# Altium project STM32MP15XXAC_2DDR3Lx16.PrjPcb (part 2 of 2)
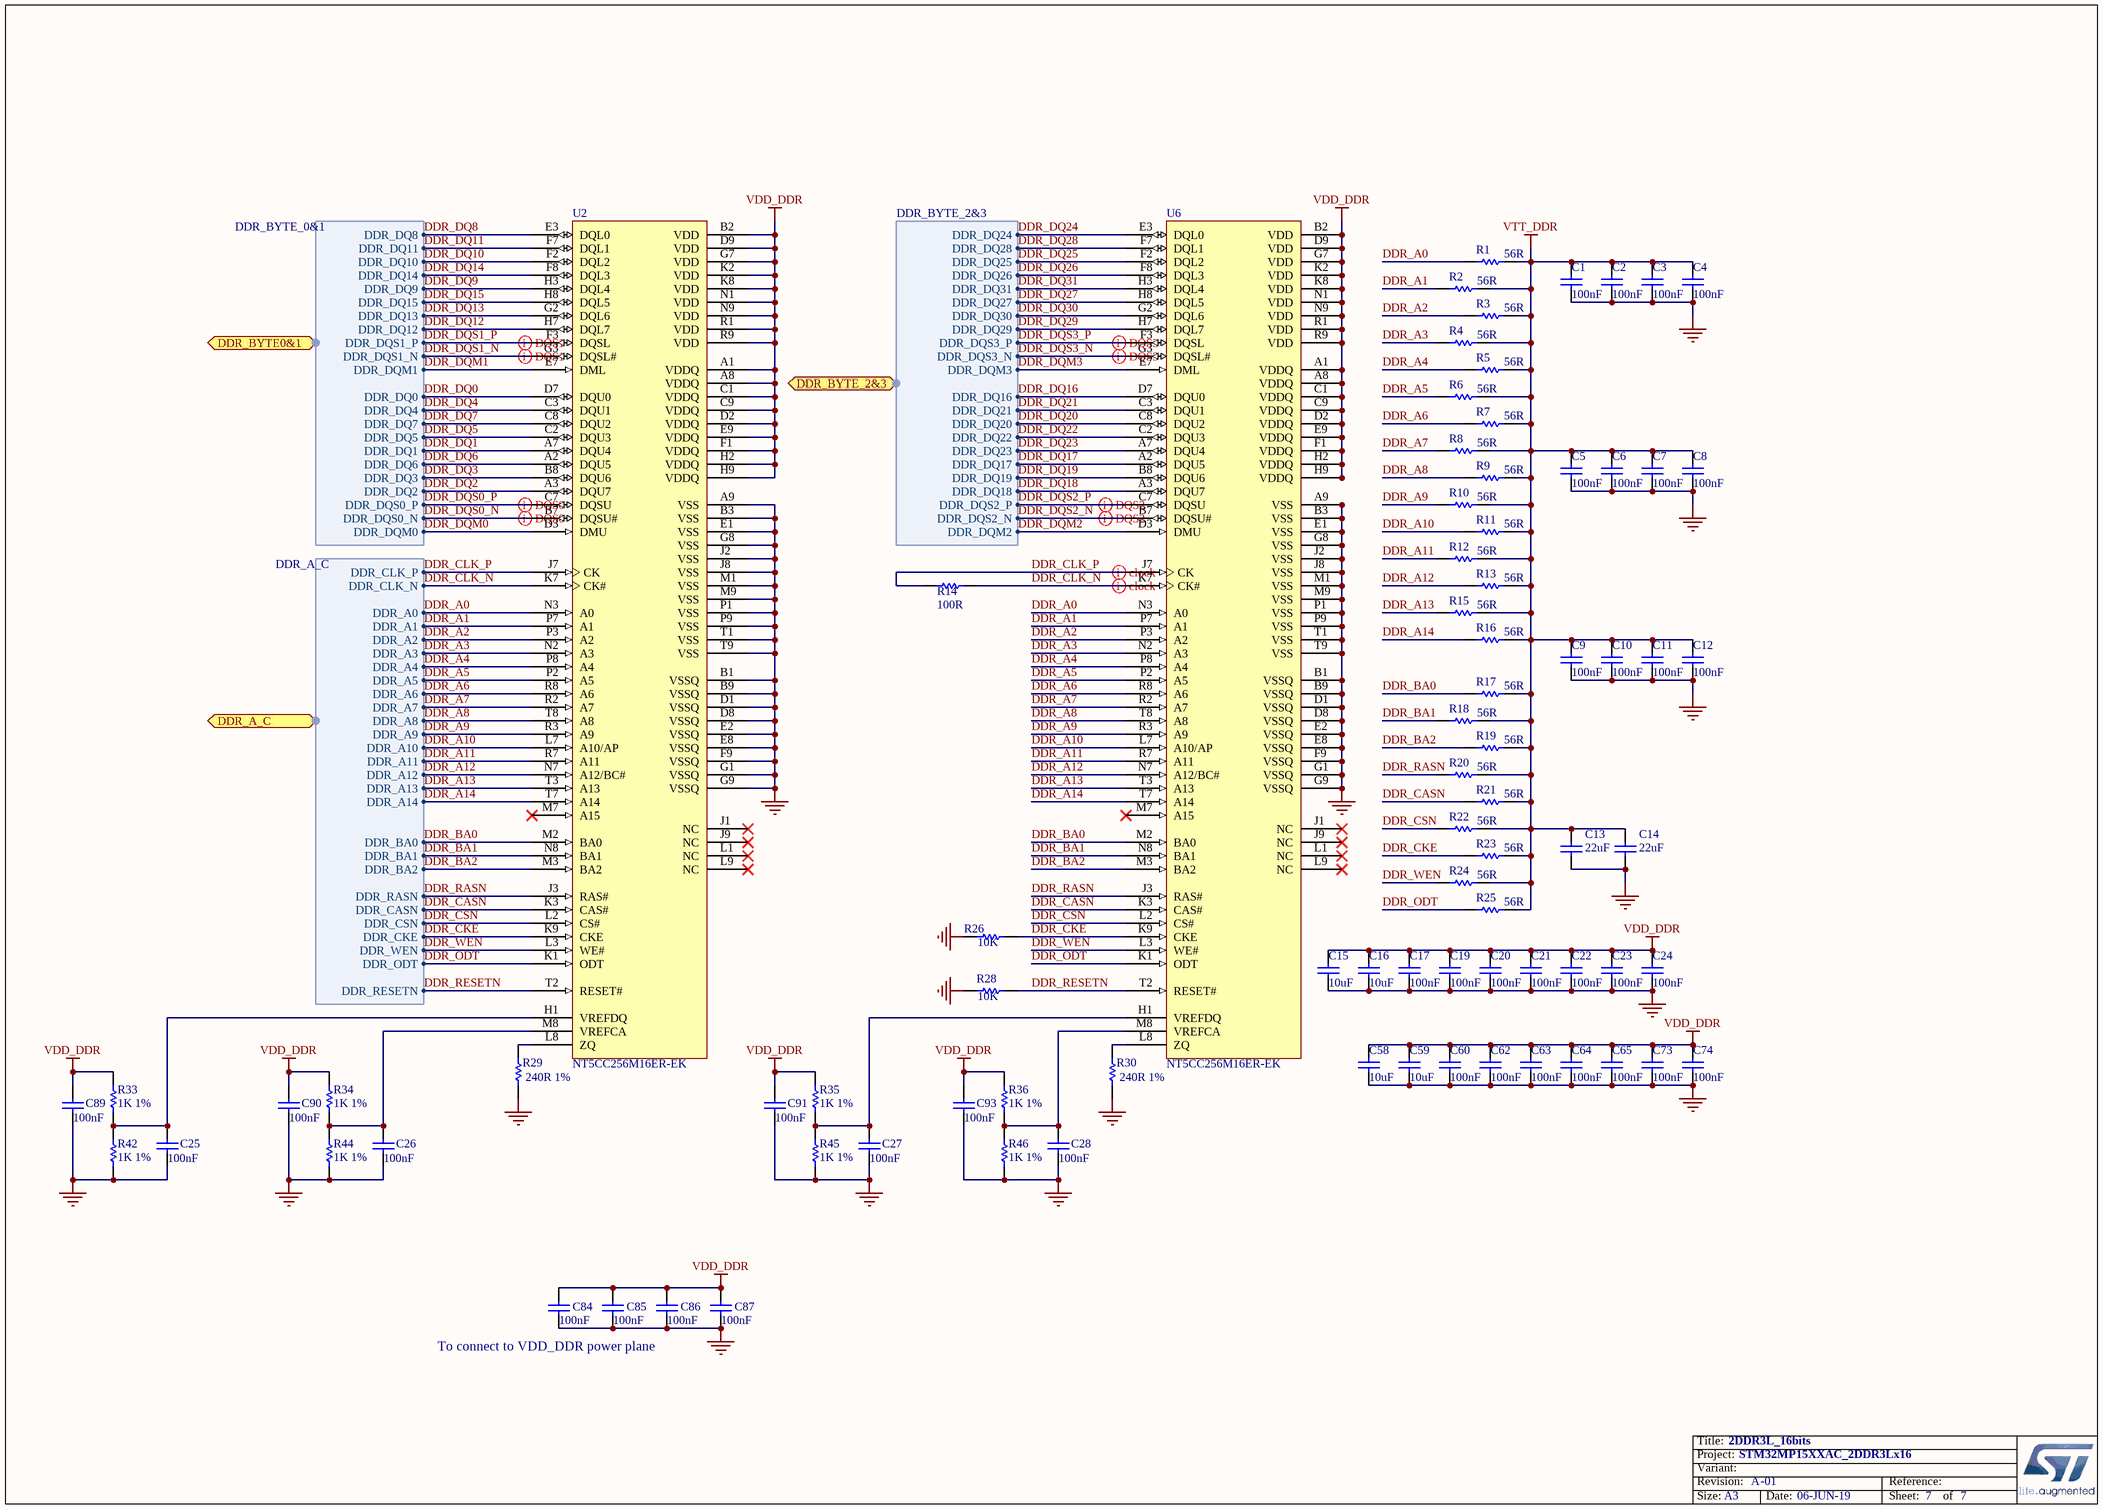
[diagram p7: 2DDR3L_16bits.SchDoc]

## Nets that join several sheets
3V3: Power_PMIC (5 pins), eMMC (6 pins)
GND: Power_PMIC (27 pins), Power_MPU (86 pins), eMMC (17 pins), STM32_MPU_IOs (5 pins), 2DDR3L_16bits (94 pins)
VDD: Power_PMIC (C38.2 L3.2 U4.31 U4.42), Power_MPU (15 pins), eMMC (8 pins), STM32_MPU_IOs (R37.1 R38.1)
VDD_CORE: Power_PMIC (C34.2 L1.2 U4.5), Power_MPU (27 pins)
VDD_DDR: Power_PMIC (5 pins), Power_MPU (16 pins), STM32_MPU_IOs (C88.2 R31.2), 2DDR3L_16bits (66 pins)
VDD_USB: Power_PMIC (C52.2 U4.39), Power_MPU (C71.2 U1.AA15 U1.AA17)
VDDA: Power_PMIC (C49.2 U4.20), Power_MPU (C70.2 R41.1 U1.1H1)
VTT_DDR: Power_PMIC (C46.2 U4.14), 2DDR3L_16bits (38 pins)
DDR_A0: STM32_MPU_IOs (U1.L20), 2DDR3L_16bits (R1.1 U2.N3 U6.N3)
DDR_A1: STM32_MPU_IOs (U1.P22), 2DDR3L_16bits (R2.1 U2.P7 U6.P7)
DDR_A2: STM32_MPU_IOs (U1.J20), 2DDR3L_16bits (R3.1 U2.P3 U6.P3)
DDR_A3: STM32_MPU_IOs (U1.K22), 2DDR3L_16bits (R4.1 U2.N2 U6.N2)
DDR_A4: STM32_MPU_IOs (U1.V20), 2DDR3L_16bits (R5.1 U2.P8 U6.P8)
DDR_A5: STM32_MPU_IOs (U1.H20), 2DDR3L_16bits (R6.1 U2.P2 U6.P2)
DDR_A6: STM32_MPU_IOs (U1.W20), 2DDR3L_16bits (R7.1 U2.R8 U6.R8)
DDR_A7: STM32_MPU_IOs (U1.E20), 2DDR3L_16bits (R8.1 U2.R2 U6.R2)
DDR_A8: STM32_MPU_IOs (U1.Y20), 2DDR3L_16bits (R9.1 U2.T8 U6.T8)
DDR_A9: STM32_MPU_IOs (U1.G20), 2DDR3L_16bits (R10.1 U2.R3 U6.R3)
DDR_A10: STM32_MPU_IOs (U1.R22), 2DDR3L_16bits (R11.1 U2.L7 U6.L7)
DDR_A11: STM32_MPU_IOs (U1.R20), 2DDR3L_16bits (R12.1 U2.R7 U6.R7)
DDR_A12: STM32_MPU_IOs (U1.P23), 2DDR3L_16bits (R13.1 U2.N7 U6.N7)
DDR_A13: STM32_MPU_IOs (U1.F20), 2DDR3L_16bits (R15.1 U2.T3 U6.T3)
DDR_A14: STM32_MPU_IOs (U1.R21), 2DDR3L_16bits (R16.1 U2.T7 U6.T7)
DDR_BA0: STM32_MPU_IOs (U1.L23), 2DDR3L_16bits (R17.1 U2.M2 U6.M2)
DDR_BA1: STM32_MPU_IOs (U1.U20), 2DDR3L_16bits (R18.1 U2.N8 U6.N8)
DDR_BA2: STM32_MPU_IOs (U1.M21), 2DDR3L_16bits (R19.1 U2.M3 U6.M3)
DDR_CASN: STM32_MPU_IOs (U1.N20), 2DDR3L_16bits (R21.1 U2.K3 U6.K3)
DDR_CKE: STM32_MPU_IOs (U1.T20), 2DDR3L_16bits (R23.1 R26.2 U2.K9 U6.K9)
DDR_CLK_N: STM32_MPU_IOs (U1.N23), 2DDR3L_16bits (R14.2 U2.K7 U6.K7)
DDR_CLK_P: STM32_MPU_IOs (U1.N22), 2DDR3L_16bits (R14.1 U2.J7 U6.J7)
DDR_CSN: STM32_MPU_IOs (U1.M22), 2DDR3L_16bits (R22.1 U2.L2 U6.L2)
DDR_DQ0: STM32_MPU_IOs (U1.E22), 2DDR3L_16bits (U2.D7)
DDR_DQ1: STM32_MPU_IOs (U1.F22), 2DDR3L_16bits (U2.A7)
DDR_DQ2: STM32_MPU_IOs (U1.H21), 2DDR3L_16bits (U2.A3)
DDR_DQ3: STM32_MPU_IOs (U1.E21), 2DDR3L_16bits (U2.B8)
DDR_DQ4: STM32_MPU_IOs (U1.J21), 2DDR3L_16bits (U2.C3)
DDR_DQ5: STM32_MPU_IOs (U1.J22), 2DDR3L_16bits (U2.C2)
DDR_DQ6: STM32_MPU_IOs (U1.H22), 2DDR3L_16bits (U2.A2)
DDR_DQ7: STM32_MPU_IOs (U1.G21), 2DDR3L_16bits (U2.C8)
DDR_DQ8: STM32_MPU_IOs (U1.T21), 2DDR3L_16bits (U2.E3)
DDR_DQ9: STM32_MPU_IOs (U1.U21), 2DDR3L_16bits (U2.H3)
DDR_DQ10: STM32_MPU_IOs (U1.T22), 2DDR3L_16bits (U2.F2)
DDR_DQ11: STM32_MPU_IOs (U1.W21), 2DDR3L_16bits (U2.F7)
DDR_DQ12: STM32_MPU_IOs (U1.W23), 2DDR3L_16bits (U2.H7)
DDR_DQ13: STM32_MPU_IOs (U1.T23), 2DDR3L_16bits (U2.G2)
DDR_DQ14: STM32_MPU_IOs (U1.W22), 2DDR3L_16bits (U2.F8)
DDR_DQ15: STM32_MPU_IOs (U1.Y21), 2DDR3L_16bits (U2.H8)
DDR_DQ16: STM32_MPU_IOs (U1.B22), 2DDR3L_16bits (U6.D7)
DDR_DQ17: STM32_MPU_IOs (U1.D22), 2DDR3L_16bits (U6.A2)
DDR_DQ18: STM32_MPU_IOs (U1.D23), 2DDR3L_16bits (U6.A3)
DDR_DQ19: STM32_MPU_IOs (U1.B21), 2DDR3L_16bits (U6.B8)
DDR_DQ20: STM32_MPU_IOs (U1.A21), 2DDR3L_16bits (U6.C8)
DDR_DQ21: STM32_MPU_IOs (U1.E23), 2DDR3L_16bits (U6.C3)
DDR_DQ22: STM32_MPU_IOs (U1.D21), 2DDR3L_16bits (U6.C2)
DDR_DQ23: STM32_MPU_IOs (U1.A22), 2DDR3L_16bits (U6.A7)
DDR_DQ24: STM32_MPU_IOs (U1.Y23), 2DDR3L_16bits (U6.E3)
DDR_DQ25: STM32_MPU_IOs (U1.Y22), 2DDR3L_16bits (U6.F2)
DDR_DQ26: STM32_MPU_IOs (U1.AB21), 2DDR3L_16bits (U6.F8)
DDR_DQ27: STM32_MPU_IOs (U1.AB20), 2DDR3L_16bits (U6.H8)
DDR_DQ28: STM32_MPU_IOs (U1.AC22), 2DDR3L_16bits (U6.F7)
DDR_DQ29: STM32_MPU_IOs (U1.AC21), 2DDR3L_16bits (U6.H7)
DDR_DQ30: STM32_MPU_IOs (U1.AA23), 2DDR3L_16bits (U6.G2)
DDR_DQ31: STM32_MPU_IOs (U1.AA22), 2DDR3L_16bits (U6.H3)
DDR_DQM0: STM32_MPU_IOs (U1.H23), 2DDR3L_16bits (U2.D3)
DDR_DQM1: STM32_MPU_IOs (U1.V22), 2DDR3L_16bits (U2.E7)
DDR_DQM2: STM32_MPU_IOs (U1.C23), 2DDR3L_16bits (U6.D3)
DDR_DQM3: STM32_MPU_IOs (U1.AA20), 2DDR3L_16bits (U6.E7)
DDR_DQS0_N: STM32_MPU_IOs (U1.G23), 2DDR3L_16bits (U2.B7)
DDR_DQS0_P: STM32_MPU_IOs (U1.G22), 2DDR3L_16bits (U2.C7)
DDR_DQS1_N: STM32_MPU_IOs (U1.U23), 2DDR3L_16bits (U2.G3)
DDR_DQS1_P: STM32_MPU_IOs (U1.U22), 2DDR3L_16bits (U2.F3)
DDR_DQS2_N: STM32_MPU_IOs (U1.B23), 2DDR3L_16bits (U6.B7)
DDR_DQS2_P: STM32_MPU_IOs (U1.C22), 2DDR3L_16bits (U6.C7)
DDR_DQS3_N: STM32_MPU_IOs (U1.AB23), 2DDR3L_16bits (U6.G3)
DDR_DQS3_P: STM32_MPU_IOs (U1.AB22), 2DDR3L_16bits (U6.F3)
DDR_ODT: STM32_MPU_IOs (U1.L22), 2DDR3L_16bits (R25.1 U2.K1 U6.K1)
DDR_RASN: STM32_MPU_IOs (U1.N21), 2DDR3L_16bits (R20.1 U2.J3 U6.J3)
DDR_RESETN: STM32_MPU_IOs (U1.D20), 2DDR3L_16bits (R28.2 U2.T2 U6.T2)
DDR_WEN: STM32_MPU_IOs (U1.M20), 2DDR3L_16bits (R24.1 U2.L3 U6.L3)
I2C4_SCL: Power_PMIC (U4.4), STM32_MPU_IOs (R37.2 U1.Y18)
I2C4_SDA: Power_PMIC (U4.3), STM32_MPU_IOs (R38.2 U1.AA19)
NRST: Power_PMIC (U4.1), STM32_MPU_IOs (U1.M3)
PA0_WKUP: Power_PMIC (U4.43), STM32_MPU_IOs (U1.AB3)
PWR_ON: Power_PMIC (U4.44), STM32_MPU_IOs (U1.R2)

## Assembly variants
Example: all parts fitted